# EAGLE schematic node_v2 (EAGLE 9.6.2)
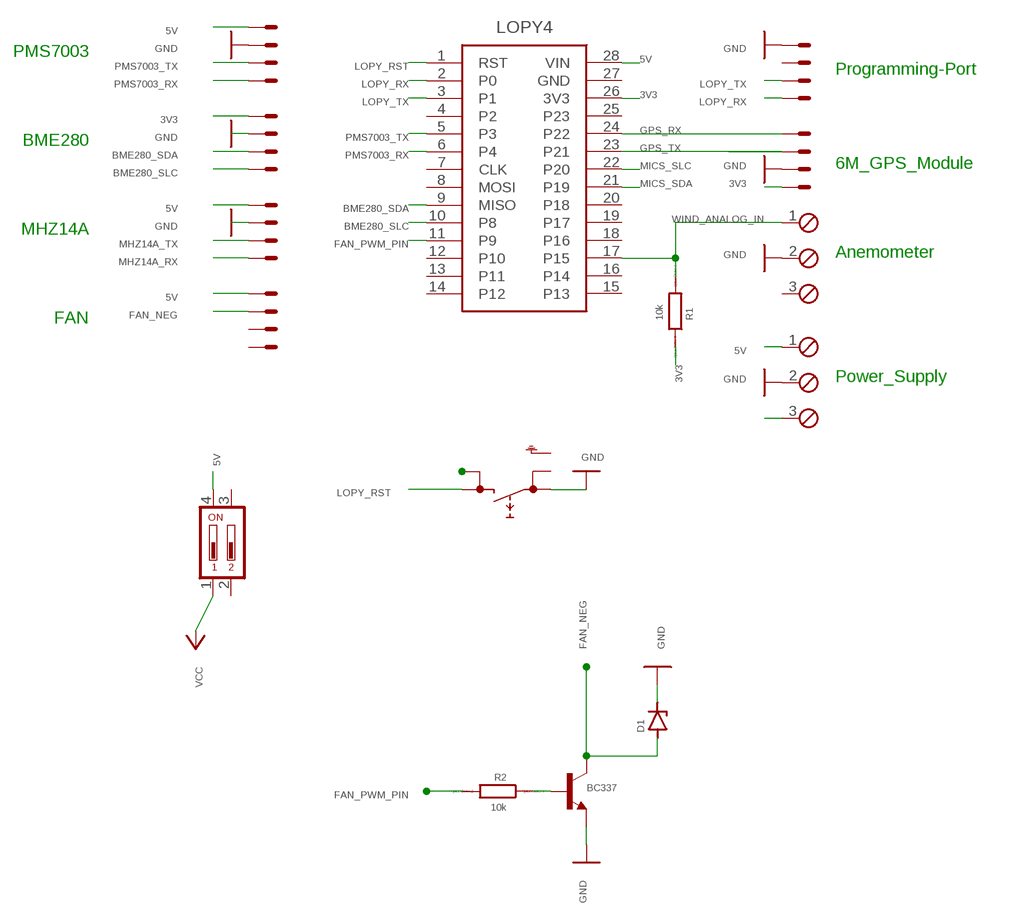
[diagram p0: schematic, sheet 1]

## Parts
D1  1N821  [DO35Z10]
IC1  LOPY4  [LOPY4]
R1  10k  R0207/10  [0207/10]
R2  10k  R0207/10  [0207/10]
S1  DA02  [DA-02]
S2  SKHMPSE010  [SKHMPXE010]
T1  BC337  [TO92]
X1  22-23-2041  [22-23-2041]
X4  22-23-2041  [22-23-2041]
X5  MPT3  [3POL254]
X6  MPT3  [3POL254]
X7  22-23-2041  [22-23-2041]
X8  22-23-2041  [22-23-2041]
X9  22-23-2041  [22-23-2041]
X10  22-23-2041  [22-23-2041]

## Nets
3V3: IC1.26(3V3) R1.1 X4.4 X8.1
5V: IC1.28(VIN) S1.4 X6.1 X7.1 X9.1 X10.1
BME280_SDA: IC1.9(MISO) X8.3
BME280_SLC: IC1.10(P8) X8.4
FAN_NEG: D1.A T1.3(C) X10.2
FAN_PWM_PIN: IC1.11(P9) R2.2
GND: D1.C S2.1(1.1) T1.1(E) X1.1 X4.3 X5.2 X6.2 X7.2 X8.2 X9.2
GPS_RX: IC1.24(P22) X4.1
GPS_TX: IC1.23(P21) X4.2
LOPY_RST: IC1.1(RST) S2.3(2.1)
LOPY_RX: IC1.2(P0)
LOPY_TX: IC1.3(P1)
MHZ14A_RX: X9.4
MHZ14A_TX: X9.3
MICS_SDA: IC1.21(P19)
MICS_SLC: IC1.22(P20)
N$1: X1.3
N$2: X1.4
N$3: S2.4(2.2)
N$4: R2.1 T1.2(B)
N$6: X6.3
PMS7003_RX: IC1.6(P4) X7.4
PMS7003_TX: IC1.5(P3) X7.3
VCC: S1.1
WIND_ANALOG_IN: IC1.17(P15) R1.2 X5.1
Unconnected: IC1.4(P2) IC1.7(CLK) IC1.8(MOSI) IC1.12(P10) IC1.13(P11) IC1.14(P12) IC1.15(P13) IC1.16(P14) IC1.18(P16) IC1.19(P17) IC1.20(P18) IC1.25(P23) IC1.27(GND) S1.2 S1.3 S2.2(1.2) S2.5(SH) X1.2 X5.3 X10.3 X10.4

## Notes on the sheet
- PMS7003
- Programming-Port
- BME280
- 6M_GPS_Module
- MHZ14A
- Anemometer
- FAN
- Power_Supply

## Library data of the parts
D1 = diode:1N821: Reference DIODE temperature compensated, 6,2 V
IC1 = LOPY4:LOPY4: Pycom Pycom LoPy4 Bluetooth Smart (BLE), LoRa, SigFox, WiFi Development Board Source: Datasheet <https://pycom.io/wp-content/uploads/2018/03/Pycom_Specsheet_LoPy4.pdf>; ARROW_PART_NUMBER: LOPY4; ARROW_PRICE-STOCK: https://www.arrow.com/en/products/lopy4/pycom-ltd; DESCRIPTION: Pycom Pycom LoPy4 Bluetooth Smart (BLE), LoRa, SigFox, WiFi Development Board; HEIGHT: 5mm; MANUFACTURER_NAME: Pycom; MANUFACTURER_PART_NUMBER: LOPY4; MOUSER_PART_NUMBER: 365-LOPY4; MOUSER_PRICE-STOCK: https://www.mouser.com/Search/Refine.aspx?Keyword=365-LOPY4
R1 R2 = eagle-ltspice:R: RESISTOR, European symbol; SPICEMODEL: 12; SPICEPREFIX: R
S1 = switch-dil:DA02: DIL/CODE SWITCH; OC_FARNELL: 1255229; OC_NEWARK: unknown
S2 = switch:SKHMP*E010: 6.2 X 6.5mm TACT Switch (SMD) Source: http://www3.alps.co.jp/WebObjects/catalog.woa/PDF/E/Switch/Tact/SKHM/SKHM.PDF
T1 = transistor:BC337: NPN TRANSISTOR
X1 X4 X7-X10 = con-molex:22-23-2041: .100" (2.54mm) Center Header - 4 Pin; MF: MOLEX; MPN: 22-23-2041; OC_FARNELL: 1462920; OC_NEWARK: 38C0355
X5 X6 = con-phoenix-254:MPT3: PHOENIX CONNECTOR; OC_FARNELL: unknown; OC_NEWARK: unknown